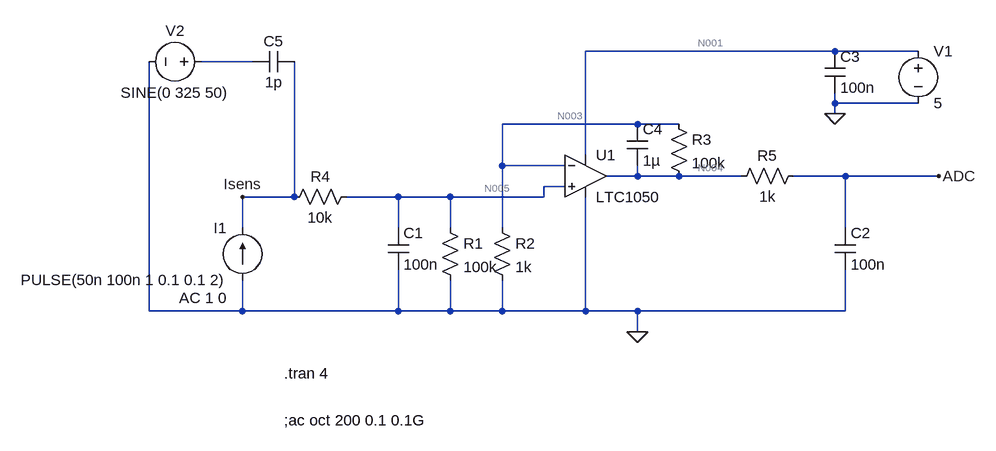
[diagram p0: schematic ElectronicAnalog1.asc]
ElectronicAnalog1.asc, the LTspice schematic file:
Version 4
SHEET 1 896 680
WIRE 672 -80 288 -80
WIRE 800 -80 672 -80
WIRE -224 -64 -304 -64
WIRE 672 0 672 -16
WIRE 800 0 672 0
WIRE 672 16 672 0
WIRE 368 32 160 32
WIRE 432 32 368 32
WIRE 288 80 288 -80
WIRE 160 96 160 32
WIRE 256 96 160 96
WIRE 368 112 368 96
WIRE 368 112 320 112
WIRE 432 112 368 112
WIRE 528 112 432 112
WIRE 688 112 608 112
WIRE 832 112 688 112
WIRE 256 128 224 128
WIRE -160 144 -160 -64
WIRE -160 144 -240 144
WIRE 0 144 -80 144
WIRE 80 144 0 144
WIRE 224 144 224 128
WIRE 224 144 80 144
WIRE -240 192 -240 144
WIRE 0 192 0 144
WIRE 80 192 80 144
WIRE 160 192 160 96
WIRE 688 192 688 112
WIRE -384 320 -384 -64
WIRE -240 320 -240 272
WIRE -240 320 -384 320
WIRE 0 320 0 256
WIRE 0 320 -240 320
WIRE 80 320 80 272
WIRE 80 320 0 320
WIRE 160 320 160 272
WIRE 160 320 80 320
WIRE 288 320 288 144
WIRE 288 320 160 320
WIRE 368 320 288 320
WIRE 688 320 688 256
WIRE 688 320 368 320
WIRE 368 352 368 320
FLAG 368 352 0
FLAG 672 16 0
FLAG -240 144 Isens
FLAG 832 112 ADC
SYMBOL res 64 176 R0
SYMATTR InstName R1
SYMATTR Value 100k
SYMBOL res 144 176 R0
SYMATTR InstName R2
SYMATTR Value 1k
SYMBOL res 416 16 R0
SYMATTR InstName R3
SYMATTR Value 100k
SYMBOL res -64 128 R90
WINDOW 0 0 56 VBottom 2
WINDOW 3 32 56 VTop 2
SYMATTR InstName R4
SYMATTR Value 10k
SYMBOL res 624 96 R90
WINDOW 0 0 56 VBottom 2
WINDOW 3 32 56 VTop 2
SYMATTR InstName R5
SYMATTR Value 1k
SYMBOL cap -16 192 R0
SYMATTR InstName C1
SYMATTR Value 100n
SYMBOL cap 672 192 R0
SYMATTR InstName C2
SYMATTR Value 100n
SYMBOL cap 656 -80 R0
SYMATTR InstName C3
SYMATTR Value 100n
SYMBOL cap 352 32 R0
SYMATTR InstName C4
SYMATTR Value 1µ
SYMBOL OpAmps\\LTC1050 288 48 R0
SYMATTR InstName U1
SYMBOL voltage 800 -96 R0
SYMATTR InstName V1
SYMATTR Value 5
SYMBOL current -240 272 R180
WINDOW 0 24 80 Left 2
WINDOW 3 24 0 Left 2
WINDOW 123 24 -28 Left 2
WINDOW 39 0 0 Left 0
SYMATTR InstName I1
SYMATTR Value PULSE(50n 100n 1 0.1 0.1 2)
SYMATTR Value2 AC 1 0
SYMBOL voltage -288 -64 R90
WINDOW 0 -32 56 VBottom 2
WINDOW 3 32 56 VTop 2
WINDOW 123 0 0 Left 0
WINDOW 39 0 0 Left 0
SYMATTR InstName V2
SYMATTR Value SINE(0 325 50)
SYMBOL cap -160 -80 R90
WINDOW 0 0 32 VBottom 2
WINDOW 3 32 32 VTop 2
SYMATTR InstName C5
SYMATTR Value 1p
TEXT -176 416 Left 2 !.tran 4
TEXT -176 488 Left 2 !;ac oct 200 0.1 0.1G

The netlist it stands for:
* ElectronicAnalog1.asc
R1 N005 0 100k
R2 N003 0 1k
R3 N003 N004 100k
R4 N005 Isens 10k
R5 ADC N004 1k
C1 N005 0 100n
C2 ADC 0 100n
C3 N001 0 100n
C4 N003 N004 1µ
XU1 N005 N003 N001 0 N004 LTC1050  ; pins In+ In- V+ V- OUT
V1 N001 0 5
I1 0 Isens PULSE(50n 100n 1 0.1 0.1 2) AC 1 0
V2 N002 0 SINE(0 325 50)
C5 Isens N002 1p
.tran 4
;ac oct 200 0.1 0.1G
.lib LTC.lib
.backanno
.end

* Results of the author's LTspice run, read from the files saved beside the schematic
* Operating Point, zero values left out:
*   V(n005) = 5 mV
*   V(n003) = 5 mV
*   V(n004) = 505 mV
*   V(isens) = 5.5 mV
*   V(adc) = 505 mV
*   V(n001) = 5 V
*   I(I1) = 50 nA
*   I(R4) = -50 nA
*   I(R3) = -5 µA
*   I(R2) = 5 µA
*   I(R1) = 50 nA
*   I(V1) = -754.1 µA
*   Ix(u1:3) = 754.1 µA
*   Ix(u1:4) = -749.1 µA
*   Ix(u1:5) = -5 µA
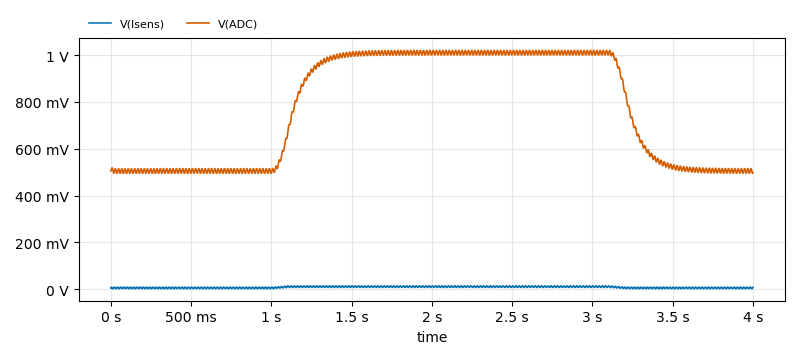
[diagram p1: Transient Analysis of ElectronicAnalog1.asc, plotted from the saved traces]
* Transient Analysis, 1 run:
*   V(Isens): min 1.788 mV, max 14.49 mV, average 8.385 mV, rms 9.15 mV, last 7.447 mV
*   V(ADC): min 494.4 mV, max 1.02 V, average 770.1 mV, rms 806.1 mV, last 496.6 mV